# Altium schematic sheet Omnetics.SchDoc
size A4; SheetNumber: 7; SheetTotal: 6
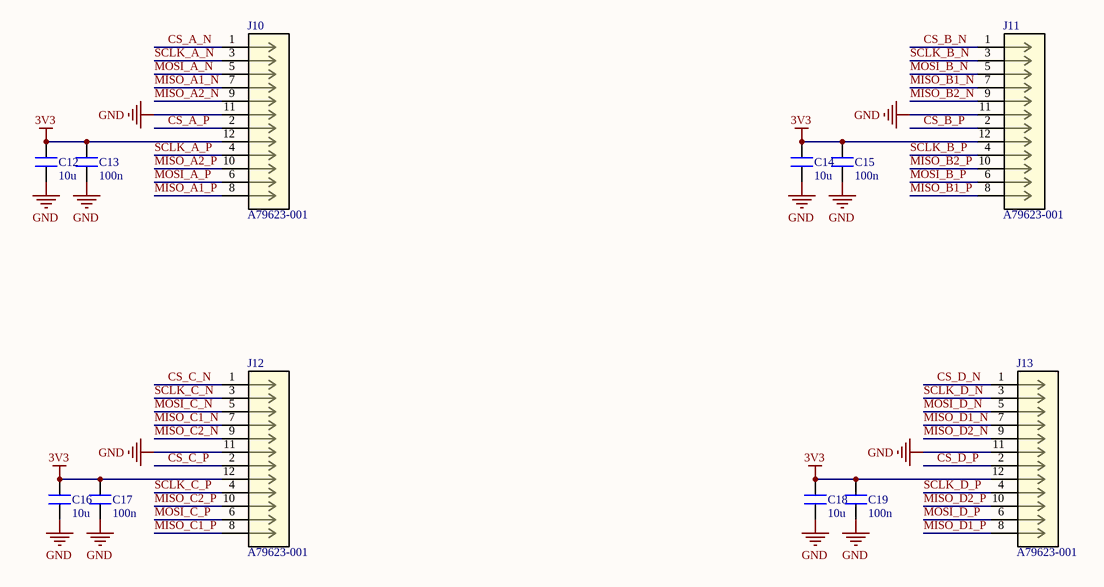
[diagram p0: Omnetics.SchDoc]

## Parts
C12  10u  [C 0603_L]
C13  100n  [C 0402_L]
C14  10u  [C 0603_L]
C15  100n  [C 0402_L]
C16  10u  [C 0603_L]
C17  100n  [C 0402_L]
C18  10u  [C 0603_L]
C19  100n  [C 0402_L]
J10  A79623-001  [CONN_A79623-001_OMN]
J11  A79623-001  [CONN_A79623-001_OMN]
J12  A79623-001  [CONN_A79623-001_OMN]
J13  A79623-001  [CONN_A79623-001_OMN]

## Nets
3V3: C12.2 C13.2 C14.2 C15.2 C16.2 C17.2 C18.2 C19.2 J10.12 J11.12 J12.12 J13.12
GND: C12.1 C13.1 C14.1 C15.1 C16.1 C17.1 C18.1 C19.1 J10.11 J11.11 J12.11 J13.11
CS_A_N: J10.1
CS_A_P: J10.2
CS_B_N: J11.1
CS_B_P: J11.2
CS_C_N: J12.1
CS_C_P: J12.2
CS_D_N: J13.1
CS_D_P: J13.2
MISO_A1_N: J10.7
MISO_A1_P: J10.8
MISO_A2_N: J10.9
MISO_A2_P: J10.10
MISO_B1_N: J11.7
MISO_B1_P: J11.8
MISO_B2_N: J11.9
MISO_B2_P: J11.10
MISO_C1_N: J12.7
MISO_C1_P: J12.8
MISO_C2_N: J12.9
MISO_C2_P: J12.10
MISO_D1_N: J13.7
MISO_D1_P: J13.8
MISO_D2_N: J13.9
MISO_D2_P: J13.10
MOSI_A_N: J10.5
MOSI_A_P: J10.6
MOSI_B_N: J11.5
MOSI_B_P: J11.6
MOSI_C_N: J12.5
MOSI_C_P: J12.6
MOSI_D_N: J13.5
MOSI_D_P: J13.6
SCLK_A_N: J10.3
SCLK_A_P: J10.4
SCLK_B_N: J11.3
SCLK_B_P: J11.4
SCLK_C_N: J12.3
SCLK_C_P: J12.4
SCLK_D_N: J13.3
SCLK_D_P: J13.4

## Library data of the parts
C12 C14 C16 C18 = C_1_8
C13 C15 C17 C19 = C_1
J10-J13 = A79623-001: Description; Manufacturer_Name: Omnetics; Copyright: Copyright (C) 2026 Ultra Librarian. All rights reserved.; Manufacturer_Part_Number: A79623-001; RefDes: RefDes; Type: Type